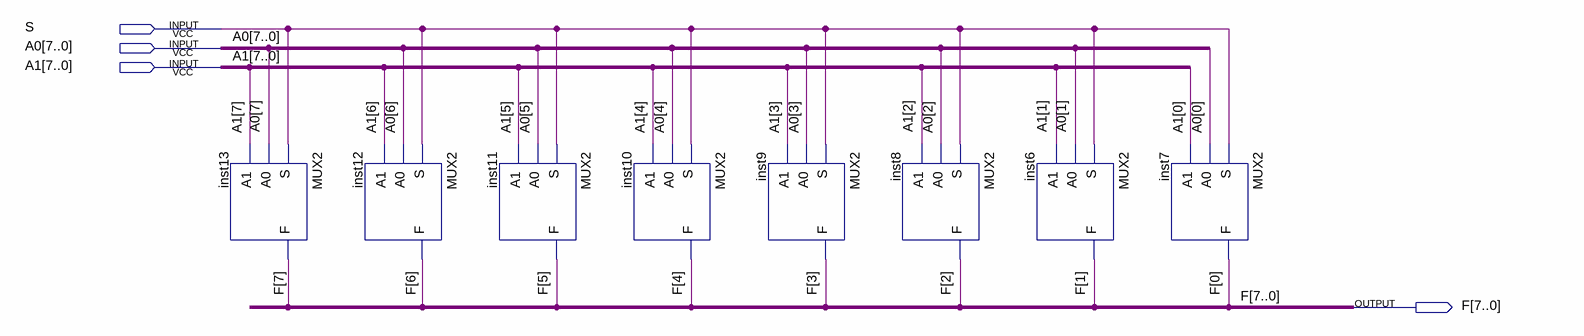
[diagram p0: schematic sheet]
// Quartus schematic MUX28.bdf as structural Verilog: 8 symbols, 4 pins
module MUX28 (
  input  S,
  input  [7:0] A0,
  input  [7:0] A1,
  output [7:0] F
);

  MUX2 inst13 (.S(S), .A0(A0[7]), .A1(A1[7]), .F(F[7]));
  MUX2 inst12 (.S(S), .A0(A0[6]), .A1(A1[6]), .F(F[6]));
  MUX2 inst11 (.S(S), .A0(A0[5]), .A1(A1[5]), .F(F[5]));
  MUX2 inst10 (.S(S), .A0(A0[4]), .A1(A1[4]), .F(F[4]));
  MUX2 inst9 (.S(S), .A0(A0[3]), .A1(A1[3]), .F(F[3]));
  MUX2 inst8 (.S(S), .A0(A0[2]), .A1(A1[2]), .F(F[2]));
  MUX2 inst6 (.S(S), .A0(A0[1]), .A1(A1[1]), .F(F[1]));
  MUX2 inst7 (.S(S), .A0(A0[0]), .A1(A1[0]), .F(F[0]));
endmodule
